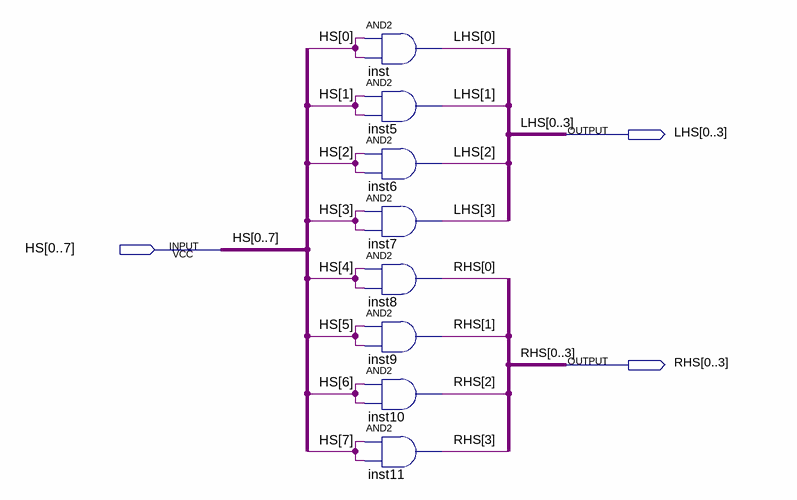
[diagram p0: schematic sheet]
// Quartus schematic splitter.bdf as structural Verilog: 8 symbols, 3 pins
module splitter (
  input  [0:7] HS,
  output [0:3] LHS,
  output [0:3] RHS
);

  and inst (LHS[0], HS[0], HS[0]);
  and inst5 (LHS[1], HS[1], HS[1]);
  and inst6 (LHS[2], HS[2], HS[2]);
  and inst7 (LHS[3], HS[3], HS[3]);
  and inst8 (RHS[0], HS[4], HS[4]);
  and inst9 (RHS[1], HS[5], HS[5]);
  and inst10 (RHS[2], HS[6], HS[6]);
  and inst11 (RHS[3], HS[7], HS[7]);
endmodule
